# Altium project Network Interface.PRJPCB
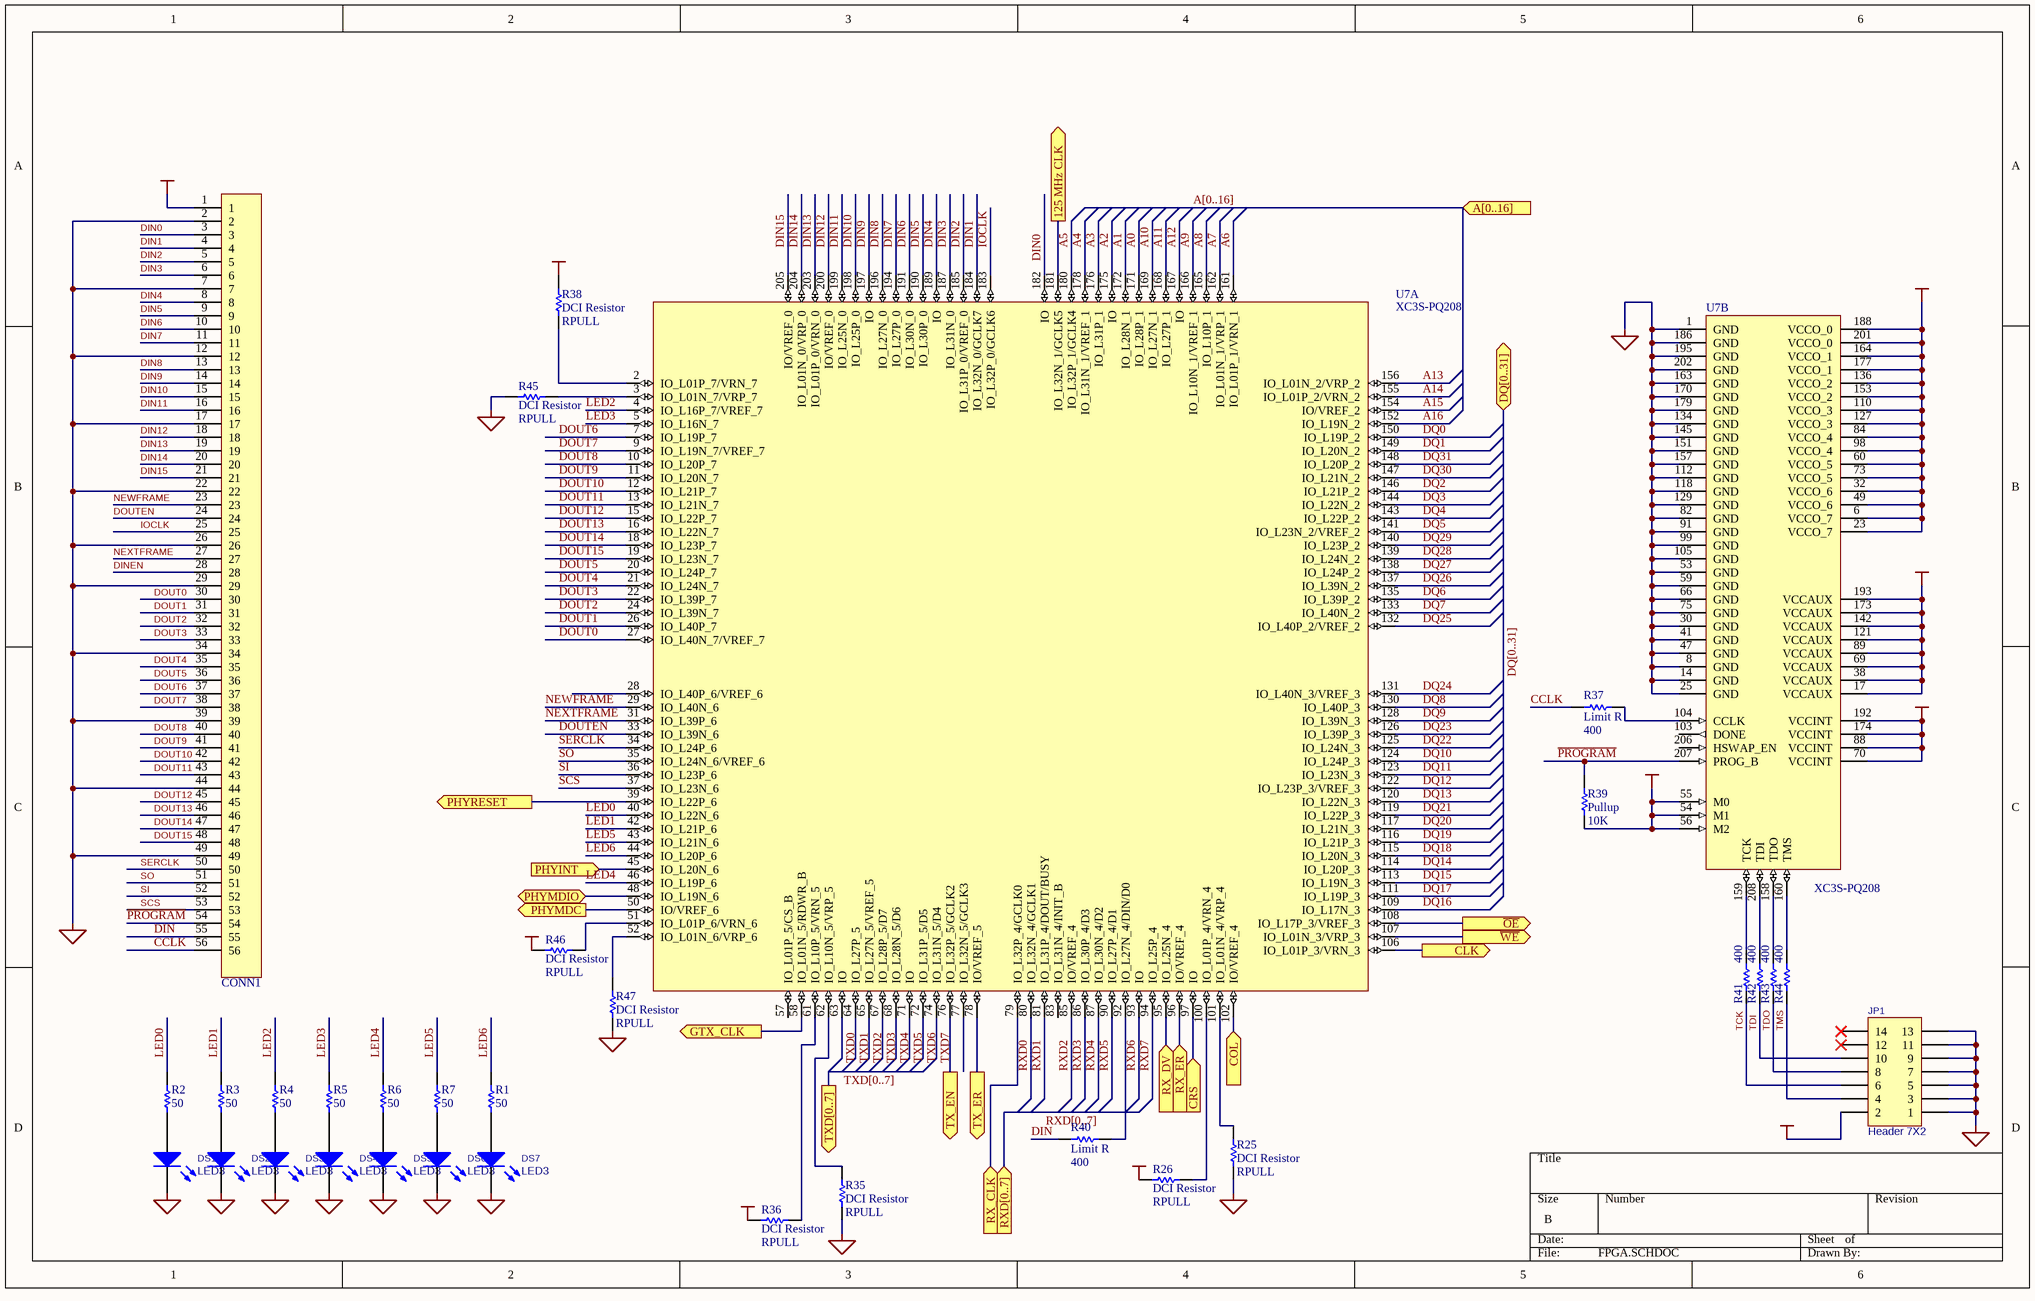
[diagram p0: FPGA.SCHDOC]
3 sheets, 152 parts. Net scope: hierarchical (ports join the sheet entries above them; power ports are global).
Board file: NIC.PCBDOC
Sheets:
  FPGA.SCHDOC
  Power and Clocks.SCHDOC
  PHY.SCHDOC

## Sheet FPGA.SCHDOC
size B

### Parts
CONN1  CON56B  [HDR56F]  (value not drawn)
DS1  LED3  [SMD _LED]
DS2  LED3  [SMD _LED]
DS3  LED3  [SMD _LED]
DS4  LED3  [SMD _LED]
DS5  LED3  [SMD _LED]
DS6  LED3  [SMD _LED]
DS7  LED3  [SMD _LED]
JP1  Header 7X2  [SMT 2x7 2mm HDR]
R1  value 50  [0603]  (hidden comment: RESISTOR)
R2  value 50  [0603]  (hidden comment: RESISTOR)
R3  value 50  [0603]  (hidden comment: RESISTOR)
R4  value 50  [0603]  (hidden comment: RESISTOR)
R5  value 50  [0603]  (hidden comment: RESISTOR)
R6  value 50  [0603]  (hidden comment: RESISTOR)
R7  value 50  [0603]  (hidden comment: RESISTOR)
R25  DCI Resistor  value RPULL  [0603]
R26  DCI Resistor  value RPULL  [0603]
R35  DCI Resistor  value RPULL  [0603]
R36  DCI Resistor  value RPULL  [0603]
R37  Limit R  value 400  [0603]
R38  DCI Resistor  value RPULL  [0603]
R39  Pullup  value 10K  [0603]
R40  Limit R  value 400  [0603]
R41  value 400  [0603]  (hidden comment: RESISTOR)
R42  value 400  [0603]  (hidden comment: RESISTOR)
R43  value 400  [0603]  (hidden comment: RESISTOR)
R44  value 400  [0603]  (hidden comment: RESISTOR)
R45  DCI Resistor  value RPULL  [0603]
R46  DCI Resistor  value RPULL  [0603]
R47  DCI Resistor  value RPULL  [0603]
U7  XC3S-PQ208  [F-QFP28X28-G208/Z32N]  (parts A,B of 2)

### Ports
125 MHz CLK (out), A[0..16] (out), CLK (out), COL (in), CRS (in), DQ[0..31] (bidir), GTX_CLK (out), PHYINT (in), PHYMDC (out), PHYMDIO (bidir), PHYRESET (out), RX_CLK (in), RX_DV (in), RX_ER (in), RXD[0..7] (in), TX_EN (out), TX_ER (out), TXD[0..7] (out), ~{OE} (out), ~{WE} (out)

### Nets
+1.2VCC: U7.70(VCCINT) U7.88(VCCINT) U7.174(VCCINT) U7.192(VCCINT)
+2.5VCC: U7.17(VCCAUX) U7.38(VCCAUX) U7.69(VCCAUX) U7.89(VCCAUX) U7.121(VCCAUX) U7.142(VCCAUX) U7.173(VCCAUX) U7.193(VCCAUX)
GND: CONN1.2 CONN1.7 CONN1.12 CONN1.17 CONN1.22 CONN1.26 CONN1.29 CONN1.34 CONN1.39 CONN1.44 CONN1.49 DS1.2(K) DS2.2(K) DS3.2(K) DS4.2(K) DS5.2(K) DS6.2(K) DS7.2(K) JP1.1 JP1.3 JP1.5 JP1.7 JP1.9 JP1.11 JP1.13 R25.1 R35.1 R45.2 R47.1 U7.1(GND) U7.8(GND) U7.14(GND) U7.25(GND) U7.30(GND) U7.41(GND) U7.47(GND) U7.53(GND) U7.59(GND) U7.66(GND) U7.75(GND) U7.82(GND) U7.91(GND) U7.99(GND) U7.105(GND) U7.112(GND) U7.118(GND) U7.129(GND) U7.134(GND) U7.145(GND) U7.151(GND) U7.157(GND) U7.163(GND) U7.170(GND) U7.179(GND) U7.186(GND) U7.195(GND) U7.202(GND)
VCC: CONN1.1 JP1.2 R26.2 R36.2 R38.2 R39.2 R46.2 U7.6(VCCO_7) U7.23(VCCO_7) U7.32(VCCO_6) U7.49(VCCO_6) U7.54(M1) U7.55(M0) U7.56(M2) U7.60(VCCO_5) U7.73(VCCO_5) U7.84(VCCO_4) U7.98(VCCO_4) U7.110(VCCO_3) U7.127(VCCO_3) U7.136(VCCO_2) U7.153(VCCO_2) U7.164(VCCO_1) U7.177(VCCO_1) U7.188(VCCO_0) U7.201(VCCO_0)
125 MHz CLK: U7.181(IO_L32N_1/GCLK5) ; port 125 MHz CLK
A0: U7.171(IO_L28P_1)
A1: U7.172(IO_L28N_1)
A2: U7.175(IO)
A3: U7.176(IO_L31P_1)
A4: U7.178(IO_L31N_1/VREF_1)
A5: U7.180(IO_L32P_1/GCLK4)
A6: U7.161(IO_L01P_1/VRN_1)
A7: U7.162(IO_L01N_1/VRP_1)
A8: U7.165(IO_L10P_1)
A9: U7.166(IO_L10N_1/VREF_1)
A10: U7.169(IO_L27N_1)
A11: U7.168(IO_L27P_1)
A12: U7.167(IO)
A13: U7.156(IO_L01N_2/VRP_2)
A14: U7.155(IO_L01P_2/VRN_2)
A15: U7.154(IO/VREF_2)
A16: U7.152(IO_L19N_2)
CCLK: CONN1.56 R37.2
CLK: U7.106(IO_L01P_3/VRN_3) ; port CLK
COL: U7.102(IO/VREF_4) ; port COL
CRS: U7.97(IO) ; port CRS
DIN: CONN1.55 R40.2
DIN0: CONN1.3 U7.182(IO)
DIN1: CONN1.4 U7.184(IO_L32N_0/GCLK7)
DIN2: CONN1.5 U7.185(IO_L31P_0/VREF_0)
DIN3: CONN1.6 U7.187(IO_L31N_0)
DIN4: CONN1.8 U7.189(IO)
DIN5: CONN1.9 U7.190(IO_L30P_0)
DIN6: CONN1.10 U7.191(IO_L30N_0)
DIN7: CONN1.11 U7.194(IO_L27P_0)
DIN8: CONN1.13 U7.196(IO_L27N_0)
DIN9: CONN1.14 U7.197(IO)
DIN10: CONN1.15 U7.198(IO_L25P_0)
DIN11: CONN1.16 U7.199(IO_L25N_0)
DIN12: CONN1.18 U7.200(IO/VREF_0)
DIN13: CONN1.19 U7.203(IO_L01P_0/VRN_0)
DIN14: CONN1.20 U7.204(IO_L01N_0/VRP_0)
DIN15: CONN1.21 U7.205(IO/VREF_0)
DINEN: CONN1.28
DOUT0: CONN1.30 U7.27(IO_L40N_7/VREF_7)
DOUT1: CONN1.31 U7.26(IO_L40P_7)
DOUT2: CONN1.32 U7.24(IO_L39N_7)
DOUT3: CONN1.33 U7.22(IO_L39P_7)
DOUT4: CONN1.35 U7.21(IO_L24N_7)
DOUT5: CONN1.36 U7.20(IO_L24P_7)
DOUT6: CONN1.37 U7.7(IO_L19P_7)
DOUT7: CONN1.38 U7.9(IO_L19N_7/VREF_7)
DOUT8: CONN1.40 U7.10(IO_L20P_7)
DOUT9: CONN1.41 U7.11(IO_L20N_7)
DOUT10: CONN1.42 U7.12(IO_L21P_7)
DOUT11: CONN1.43 U7.13(IO_L21N_7)
DOUT12: CONN1.45 U7.15(IO_L22P_7)
DOUT13: CONN1.46 U7.16(IO_L22N_7)
DOUT14: CONN1.47 U7.18(IO_L23P_7)
DOUT15: CONN1.48 U7.19(IO_L23N_7)
DOUTEN: CONN1.24 U7.33(IO_L39N_6)
DQ0: U7.150(IO_L19P_2)
DQ1: U7.149(IO_L20N_2)
DQ2: U7.146(IO_L21P_2)
DQ3: U7.144(IO_L22N_2)
DQ4: U7.143(IO_L22P_2)
DQ5: U7.141(IO_L23N_2/VREF_2)
DQ6: U7.135(IO_L39P_2)
DQ7: U7.133(IO_L40N_2)
DQ8: U7.130(IO_L40P_3)
DQ9: U7.128(IO_L39N_3)
DQ10: U7.124(IO_L24P_3)
DQ11: U7.123(IO_L23N_3)
DQ12: U7.122(IO_L23P_3/VREF_3)
DQ13: U7.120(IO_L22N_3)
DQ14: U7.114(IO_L20P_3)
DQ15: U7.113(IO_L19N_3)
DQ16: U7.109(IO_L17N_3)
DQ17: U7.111(IO_L19P_3)
DQ18: U7.115(IO_L20N_3)
DQ19: U7.116(IO_L21P_3)
DQ20: U7.117(IO_L21N_3)
DQ21: U7.119(IO_L22P_3)
DQ22: U7.125(IO_L24N_3)
DQ23: U7.126(IO_L39P_3)
DQ24: U7.131(IO_L40N_3/VREF_3)
DQ25: U7.132(IO_L40P_2/VREF_2)
DQ26: U7.137(IO_L39N_2)
DQ27: U7.138(IO_L24P_2)
DQ28: U7.139(IO_L24N_2)
DQ29: U7.140(IO_L23P_2)
DQ30: U7.147(IO_L21N_2)
DQ31: U7.148(IO_L20P_2)
GTX_CLK: U7.58(IO_L01N_5/RDWR_B) ; port GTX_CLK
IOCLK: CONN1.25 U7.183(IO_L32P_0/GCLK6)
LED0: R2.2 U7.40(IO_L22N_6)
LED1: R3.2 U7.42(IO_L21P_6)
LED2: R4.2 U7.4(IO_L16P_7/VREF_7)
LED3: R5.2 U7.5(IO_L16N_7)
LED4: R6.2 U7.46(IO_L19P_6)
LED5: R7.2 U7.43(IO_L21N_6)
LED6: R1.2 U7.44(IO_L20P_6)
NEWFRAME: CONN1.23 U7.29(IO_L40N_6)
NEXTFRAME: CONN1.27 U7.31(IO_L39P_6)
~{OE}: U7.108(IO_L17P_3/VREF_3) ; port ~{OE}
~{PROGRAM}: CONN1.54 R39.1 U7.207(PROG_B)
PHYINT: U7.45(IO_L20N_6) ; port PHYINT
PHYMDC: U7.50(IO/VREF_6) ; port PHYMDC
PHYMDIO: U7.48(IO_L19N_6) ; port PHYMDIO
PHYRESET: U7.39(IO_L22P_6) ; port PHYRESET
RX_CLK: U7.79(IO_L32P_4/GCLK0) ; port RX_CLK
RX_DV: U7.95(IO_L25N_4) ; port RX_DV
RX_ER: U7.96(IO/VREF_4) ; port RX_ER
RXD0: U7.80(IO_L32N_4/GCLK1)
RXD1: U7.81(IO_L31P_4/DOUT/BUSY)
RXD2: U7.85(IO/VREF_4)
RXD3: U7.86(IO_L30P_4/D3)
RXD4: U7.87(IO_L30N_4/D2)
RXD5: U7.90(IO_L27P_4/D1)
RXD6: U7.93(IO)
RXD7: U7.94(IO_L25P_4)
SCS: CONN1.53 U7.37(IO_L23N_6)
SERCLK: CONN1.50 U7.34(IO_L24P_6)
SI: CONN1.52 U7.36(IO_L23P_6)
SO: CONN1.51 U7.35(IO_L24N_6/VREF_6)
TCK: JP1.6 R41.2
TDI: JP1.10 R42.2
TDO: JP1.8 R43.2
TMS: JP1.4 R44.2
TX_EN: U7.76(IO_L32P_5/GCLK2) ; port TX_EN
TX_ER: U7.78(IO/VREF_5) ; port TX_ER
TXD0: U7.63(IO)
TXD1: U7.64(IO_L27P_5)
TXD2: U7.65(IO_L27N_5/VREF_5)
TXD3: U7.67(IO_L28P_5/D7)
TXD4: U7.68(IO_L28N_5/D6)
TXD5: U7.71(IO)
TXD6: U7.72(IO_L31P_5/D5)
TXD7: U7.74(IO_L31N_5/D4)
~{WE}: U7.107(IO_L01N_3/VRP_3) ; port ~{WE}
NetDS1_1: DS1.1(A) R2.1
NetDS2_1: DS2.1(A) R3.1
NetDS3_1: DS3.1(A) R4.1
NetDS4_1: DS4.1(A) R5.1
NetDS5_1: DS5.1(A) R6.1
NetDS6_1: DS6.1(A) R7.1
NetDS7_1: DS7.1(A) R1.1
NetR25_2: R25.2 U7.101(IO_L01N_4/VRP_4)
NetR26_1: R26.1 U7.100(IO_L01P_4/VRN_4)
NetR35_2: R35.2 U7.62(IO_L10N_5/VRP_5)
NetR36_1: R36.1 U7.61(IO_L10P_5/VRN_5)
NetR37_1: R37.1 U7.104(CCLK)
NetR38_1: R38.1 U7.2(IO_L01P_7/VRN_7)
NetR40_1: R40.1 U7.92(IO_L27N_4/DIN/D0)
NetR41_1: R41.1 U7.159(TCK)
NetR42_1: R42.1 U7.208(TDI)
NetR43_1: R43.1 U7.158(TDO)
NetR44_1: R44.1 U7.160(TMS)
NetR45_1: R45.1 U7.3(IO_L01N_7/VRP_7)
NetR46_1: R46.1 U7.51(IO_L01P_6/VRN_6)
NetR47_2: R47.2 U7.52(IO_L01N_6/VRP_6)

Not connected (* = marked no-connect by the designer): JP1 12* 14*; U7 28(IO_L40P_6/VREF_6) 57(IO_L01P_5/CS_B) 77(IO_L32N_5/GCLK3) 83(IO_L31N_4/INIT_B) 103(DONE) 206(HSWAP_EN)

### Buses and harness runs
bus A[0..16] = port A[0..16]
bus DQ[0..31] = port DQ[0..31]
bus RXD[0..7] = port RXD[0..7]
bus TXD[0..7] = port TXD[0..7]

### Library data of the parts
DS1-DS7 = LED3: Typical BLUE SiC LED; Published: 8-Jun-2000; LatestRevisionDate: 17-Dec-2003; LatestRevisionNote: PCB Footprint replaced.; Publisher: Altium Limited
JP1 = Header 7X2: Header, 7-Pin, Dual row; Manufacturer: Generic Components; Class I: Connector; Revision: July-2002: Re-released for DXP Platform.; Publisher: Altium Limited
R1-R7 R37 R40-R44 = RESISTOR: Standard Passive Resistor; Tolerance: 1%
R25 R26 R35 R36 R38 R39 R45-R47 = Res1: Resistor; Manufacturer: Generic Components; Class I: Passive; Published: 8-Jun-2000; Revision: July-2002: Re-released for DXP Platform.; Publisher: Altium Limited; Class II: Resistor
U7 = XC3S-PQ208: Xilinx Spartan-3 PQ208

## Sheet Power and Clocks.SCHDOC
size B
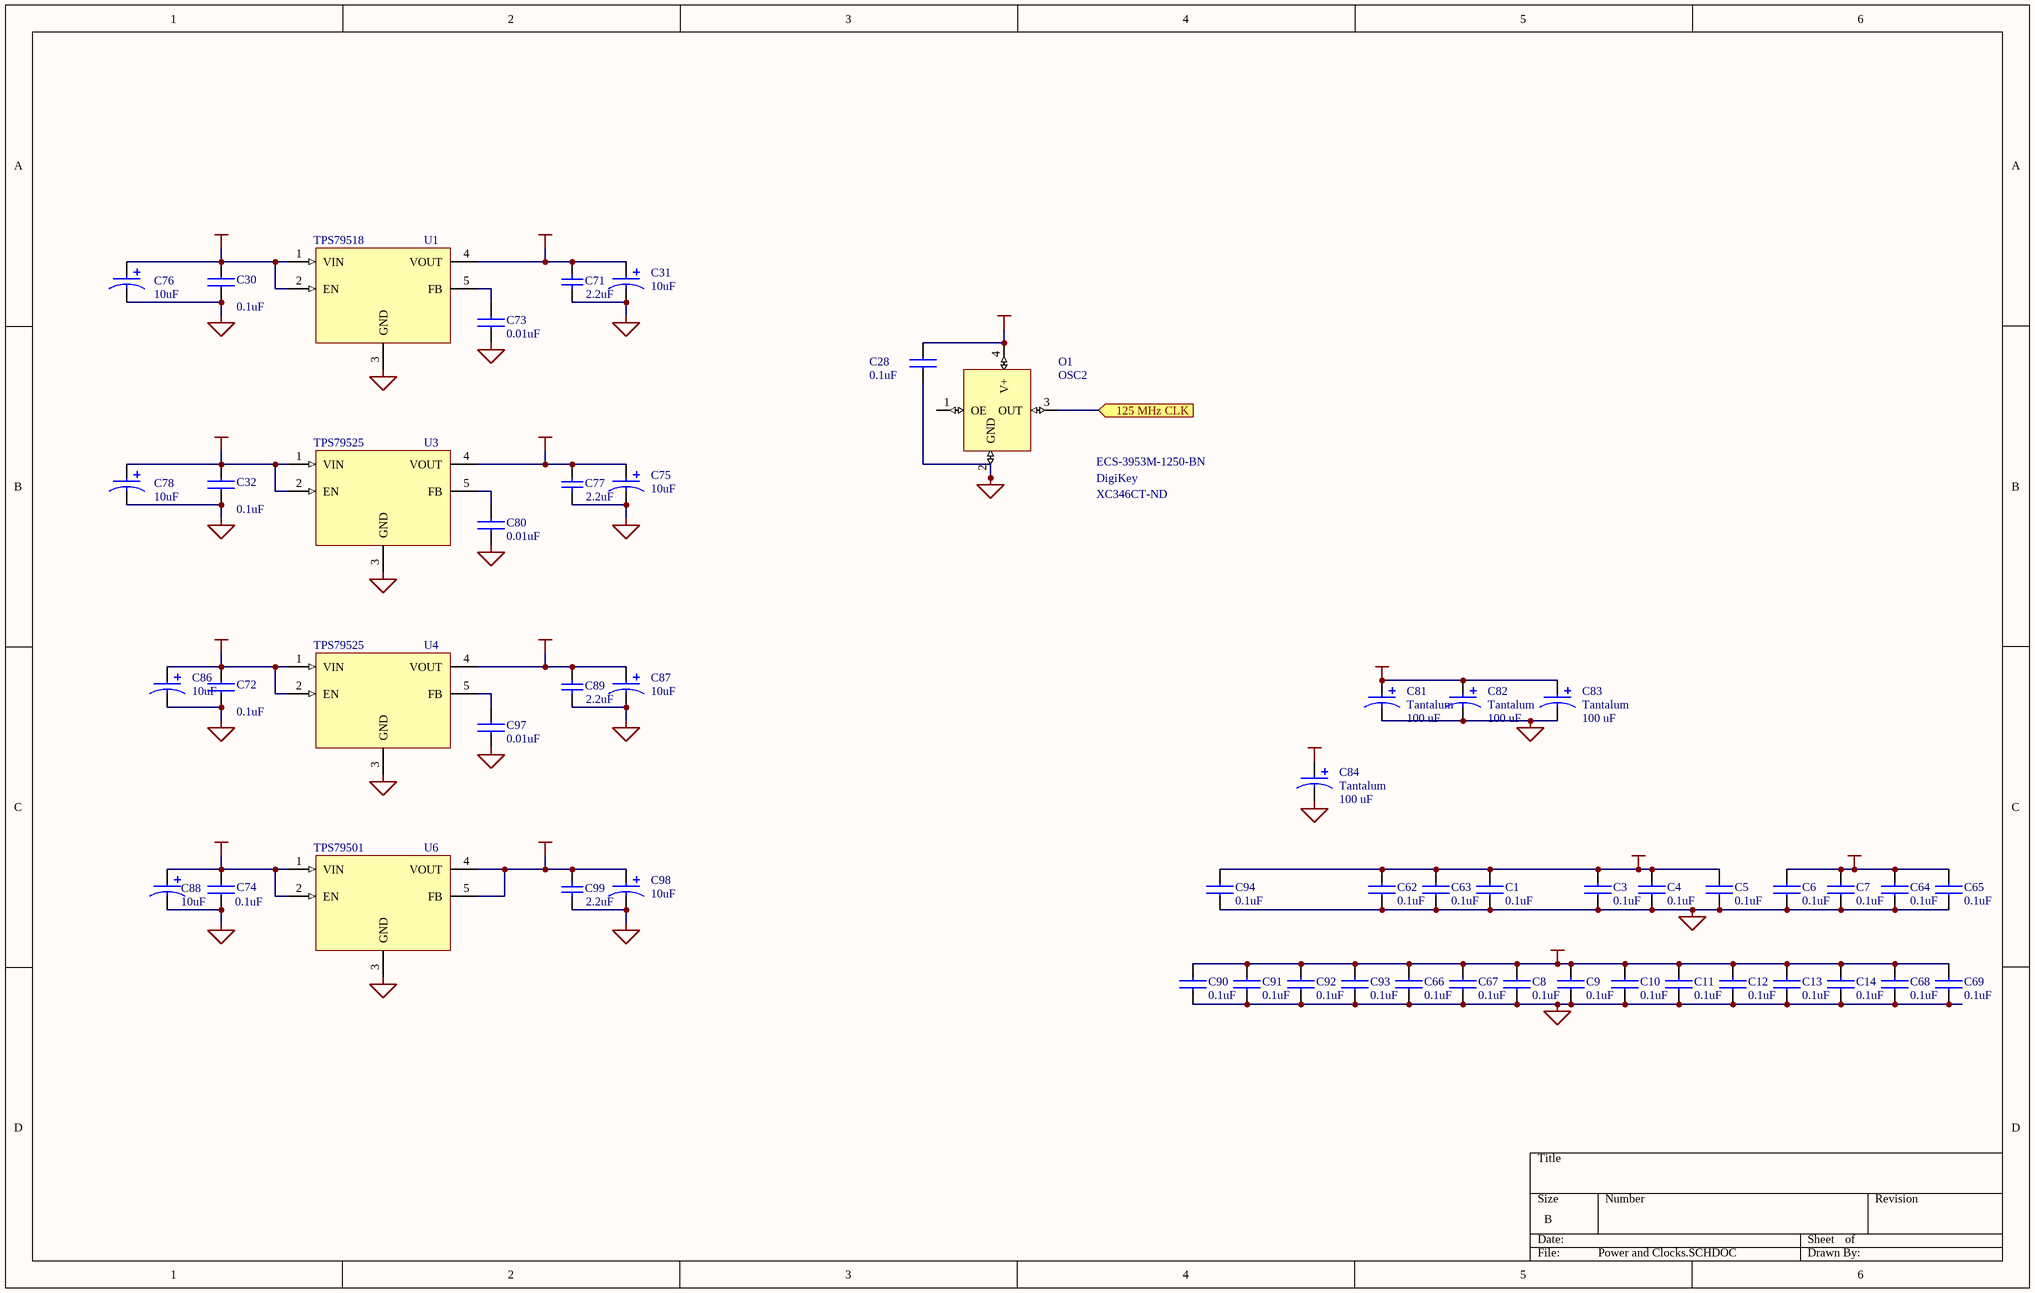
[diagram p1: Power and Clocks.SCHDOC]

### Parts
C1  value 0.1uF  [0603]  (hidden comment: CAPACITOR)
C3  value 0.1uF  [0603]  (hidden comment: CAPACITOR)
C4  value 0.1uF  [0603]  (hidden comment: CAPACITOR)
C5  value 0.1uF  [0603]  (hidden comment: CAPACITOR)
C6  value 0.1uF  [0603]  (hidden comment: CAPACITOR)
C7  value 0.1uF  [0603]  (hidden comment: CAPACITOR)
C8  value 0.1uF  [0603]  (hidden comment: CAPACITOR)
C9  value 0.1uF  [0603]  (hidden comment: CAPACITOR)
C10  value 0.1uF  [0603]  (hidden comment: CAPACITOR)
C11  value 0.1uF  [0603]  (hidden comment: CAPACITOR)
C12  value 0.1uF  [0603]  (hidden comment: CAPACITOR)
C13  value 0.1uF  [0603]  (hidden comment: CAPACITOR)
C14  value 0.1uF  [0603]  (hidden comment: CAPACITOR)
C28  value 0.1uF  [0603]  (hidden comment: CAPACITOR)
C30  value 0.1uF  [0603]  (hidden comment: CAPACITOR)
C31  value 10uF  [6032]  (hidden comment: POLCAP2)
C32  value 0.1uF  [0603]  (hidden comment: CAPACITOR)
C62  value 0.1uF  [0603]  (hidden comment: CAPACITOR)
C63  value 0.1uF  [0603]  (hidden comment: CAPACITOR)
C64  value 0.1uF  [0603]  (hidden comment: CAPACITOR)
C65  value 0.1uF  [0603]  (hidden comment: CAPACITOR)
C66  value 0.1uF  [0603]  (hidden comment: CAPACITOR)
C67  value 0.1uF  [0603]  (hidden comment: CAPACITOR)
C68  value 0.1uF  [0603]  (hidden comment: CAPACITOR)
C69  value 0.1uF  [0603]  (hidden comment: CAPACITOR)
C71  value 2.2uF  [1206]  (hidden comment: Cap)
C72  value 0.1uF  [0603]  (hidden comment: CAPACITOR)
C73  value 0.01uF  [0402]  (hidden comment: CAPACITOR)
C74  value 0.1uF  [0603]  (hidden comment: CAPACITOR)
C75  value 10uF  [6032]  (hidden comment: POLCAP2)
C76  value 10uF  [6032]  (hidden comment: POLCAP2)
C77  value 2.2uF  [1206]  (hidden comment: Cap)
C78  value 10uF  [6032]  (hidden comment: POLCAP2)
C80  value 0.01uF  [0402]  (hidden comment: CAPACITOR)
C81  Tantalum  value 100 uF  [6032]
C82  Tantalum  value 100 uF  [6032]
C83  Tantalum  value 100 uF  [6032]
C84  Tantalum  value 100 uF  [6032]
C86  value 10uF  [6032]  (hidden comment: POLCAP2)
C87  value 10uF  [6032]  (hidden comment: POLCAP2)
C88  value 10uF  [6032]  (hidden comment: POLCAP2)
C89  value 2.2uF  [1206]  (hidden comment: Cap)
C90  value 0.1uF  [0603]  (hidden comment: CAPACITOR)
C91  value 0.1uF  [0603]  (hidden comment: CAPACITOR)
C92  value 0.1uF  [0603]  (hidden comment: CAPACITOR)
C93  value 0.1uF  [0603]  (hidden comment: CAPACITOR)
C94  value 0.1uF  [0603]  (hidden comment: CAPACITOR)
C97  value 0.01uF  [0402]  (hidden comment: CAPACITOR)
C98  value 10uF  [6032]  (hidden comment: POLCAP2)
C99  value 2.2uF  [1206]  (hidden comment: Cap)
O1  OSC2  Part: ECS-3953M-1250-BN  Vendor: DigiKey  VendorPart: XC346CT-ND  [ECS-3953M]
U1  TPS79518  [SOT223-5/Simple]
U3  TPS79525  [SOT223-5/Simple]
U4  TPS79525  [SOT223-5/Simple]
U6  TPS79501  [SOT223-5/Simple]

### Ports
125 MHz CLK (in)

### Nets
+1.2VCC: C6.2 C7.2 C64.2 C65.2 C98.1 C99.2 U6.4(VOUT) U6.5(FB)
+1.8VCC: C31.1 C71.2 C84.1 U1.4(VOUT)
+2.5VCC: C1.2 C3.2 C4.2 C5.2 C62.2 C63.2 C75.1 C77.2 C94.2 U3.4(VOUT)
+2.5VPHY: C87.1 C89.2 U4.4(VOUT)
GND: C1.1 C3.1 C4.1 C5.1 C6.1 C7.1 C8.1 C9.1 C10.1 C11.1 C12.1 C13.1 C14.1 C28.1 C30.1 C31.2 C32.1 C62.1 C63.1 C64.1 C65.1 C66.1 C67.1 C68.1 C69.1 C71.1 C72.1 C73.1 C74.1 C75.2 C76.2 C77.1 C78.2 C80.1 C81.2 C82.2 C83.2 C84.2 C86.2 C87.2 C88.2 C89.1 C90.1 C91.1 C92.1 C93.1 C94.1 C97.1 C98.2 C99.1 O1.2(GND) U1.3(GND) U3.3(GND) U4.3(GND) U6.3(GND)
VCC: C8.2 C9.2 C10.2 C11.2 C12.2 C13.2 C14.2 C28.2 C30.2 C32.2 C66.2 C67.2 C68.2 C69.2 C72.2 C74.2 C76.1 C78.1 C81.1 C82.1 C83.1 C86.1 C88.1 C90.2 C91.2 C92.2 C93.2 O1.4(V+) U1.1(VIN) U1.2(EN) U3.1(VIN) U3.2(EN) U4.1(VIN) U4.2(EN) U6.1(VIN) U6.2(EN)
125 MHz CLK: O1.3(OUT) ; port 125 MHz CLK
NetC73_2: C73.2 U1.5(FB)
NetC80_2: C80.2 U3.5(FB)
NetC97_2: C97.2 U4.5(FB)

Not connected (* = marked no-connect by the designer): O1 1(OE)

### Library data of the parts
C1 C3-C14 C28 C30 C32 C62-C69 C72-C74 C80 C90-C94 C97 = CAPACITOR: Standard Capacitor
C31 C75 C76 C78 C81-C84 C86-C88 C98 = POLCAP2: Standard Capacitor
C71 C77 C89 C99 = Cap: Capacitor; Manufacturer: Generic Components; Class I: Passive; Published: 8-Jun-2000; Revision: July-2002: Re-released for DXP Platform.; Publisher: Altium Limited; Class II: Capacitor
O1 = OSC2: ECS SMD Oscillator, ECS-3953M
U1 U3 U4 U6 = TPS795XX: TI Ultra-low-noise LDO

## Sheet PHY.SCHDOC
size B
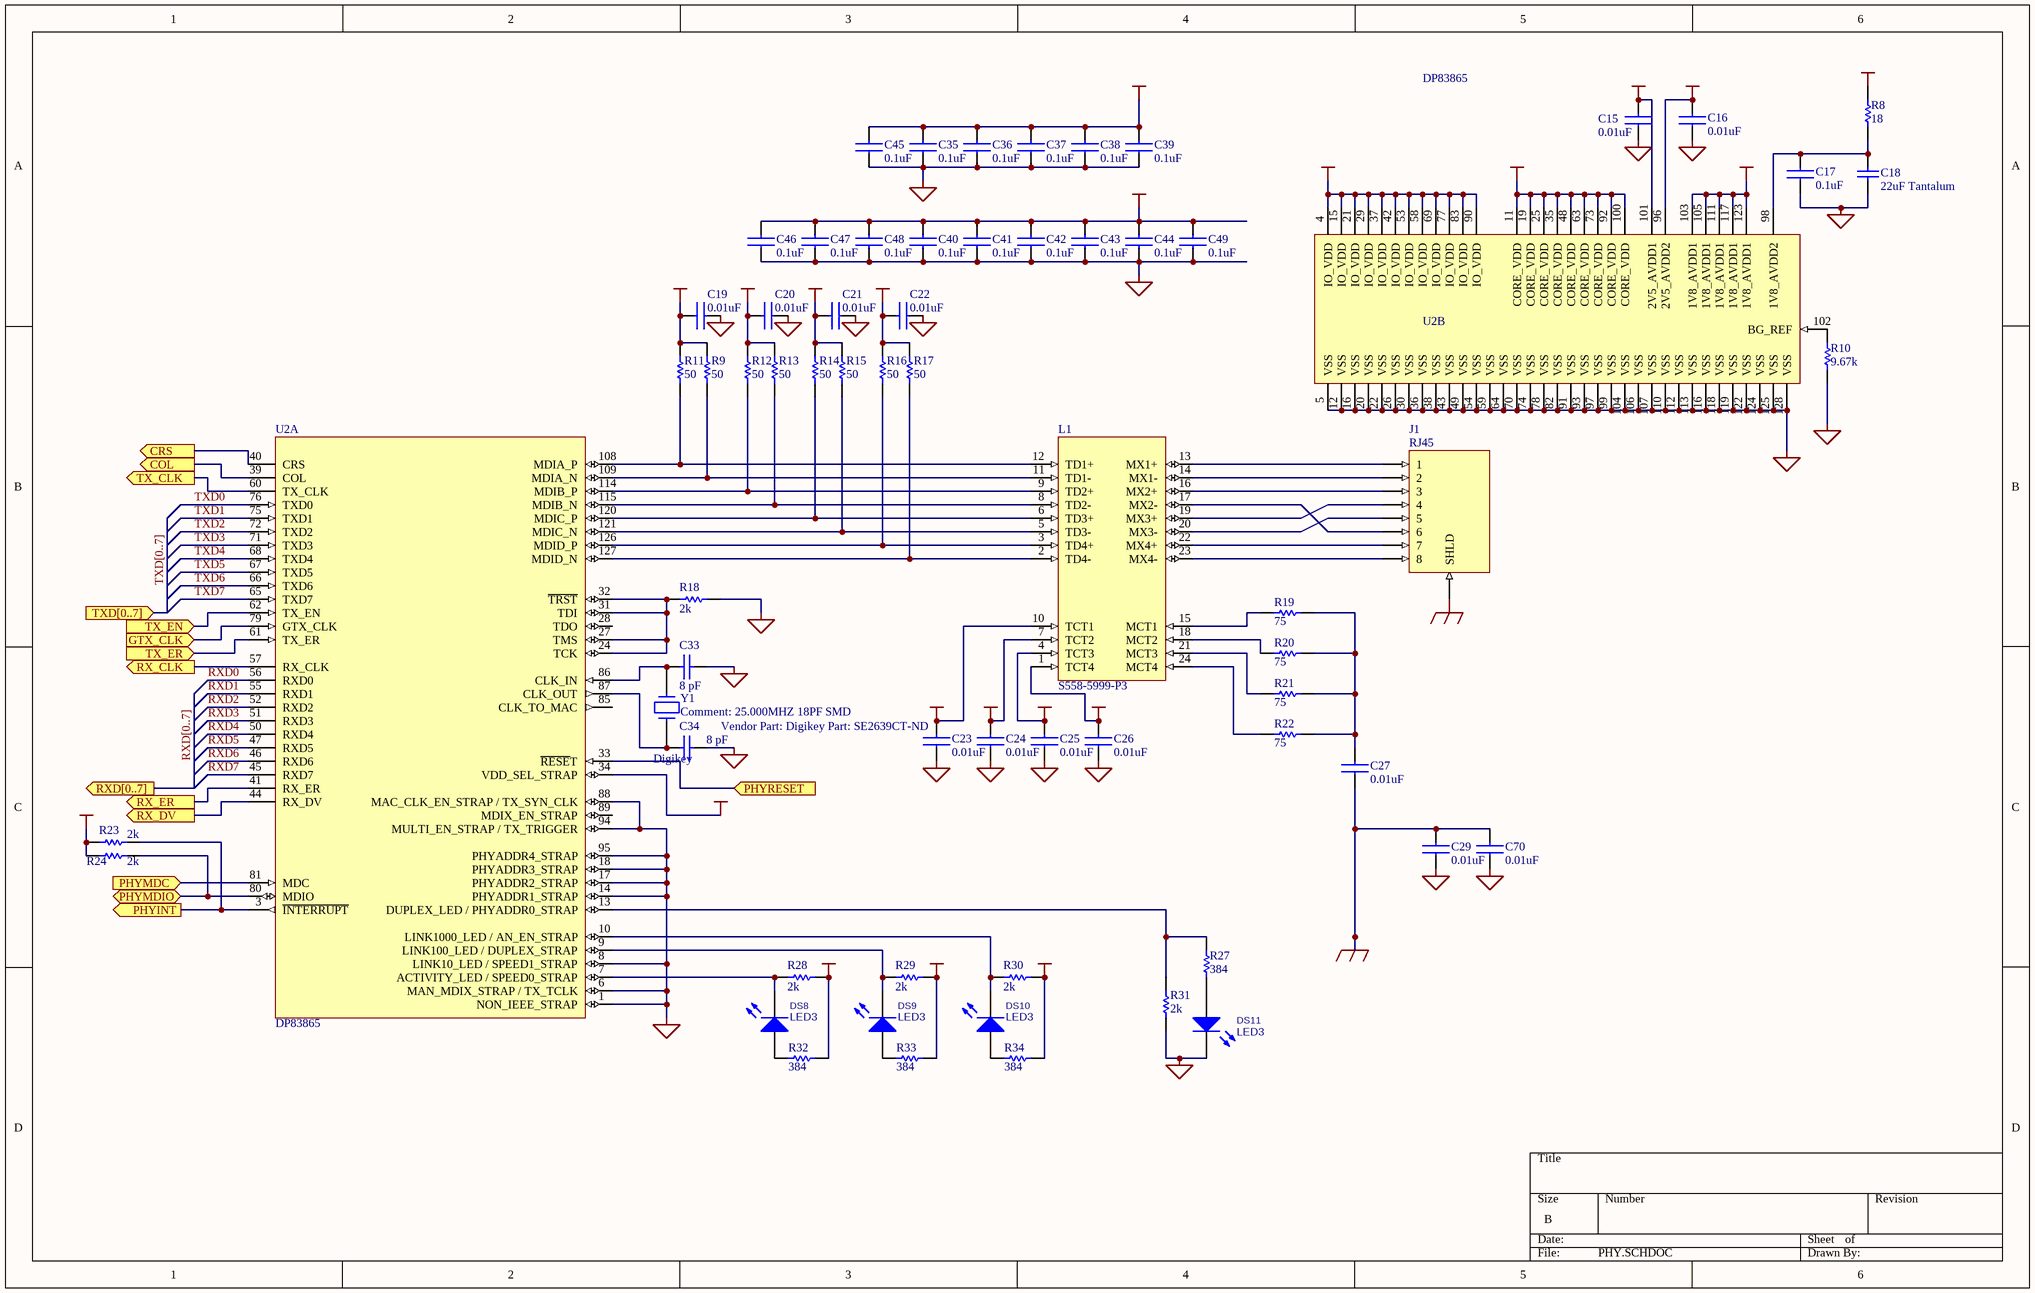
[diagram p2: PHY.SCHDOC]

### Parts
C15  value 0.01uF  [0402]  (hidden comment: CAPACITOR)
C16  value 0.01uF  [0402]  (hidden comment: CAPACITOR)
C17  value 0.1uF  [0603]  (hidden comment: CAPACITOR)
C18  value 22uF Tantalum  [TC7343-2917]  (hidden comment: Cap)
C19  value 0.01uF  [0402]  (hidden comment: CAPACITOR)
C20  value 0.01uF  [0402]  (hidden comment: CAPACITOR)
C21  value 0.01uF  [0402]  (hidden comment: CAPACITOR)
C22  value 0.01uF  [0402]  (hidden comment: CAPACITOR)
C23  value 0.01uF  [0402]  (hidden comment: CAPACITOR)
C24  value 0.01uF  [0402]  (hidden comment: CAPACITOR)
C25  value 0.01uF  [0402]  (hidden comment: CAPACITOR)
C26  value 0.01uF  [0402]  (hidden comment: CAPACITOR)
C27  value 0.01uF  [0402]  (hidden comment: CAPACITOR)
C29  value 0.01uF  [0402]  (hidden comment: CAPACITOR)
C33  8 pF  [0603]
C34  8 pF  [0603]
C35  value 0.1uF  [0603]  (hidden comment: CAPACITOR)
C36  value 0.1uF  [0603]  (hidden comment: CAPACITOR)
C37  value 0.1uF  [0603]  (hidden comment: CAPACITOR)
C38  value 0.1uF  [0603]  (hidden comment: CAPACITOR)
C39  value 0.1uF  [0603]  (hidden comment: CAPACITOR)
C40  value 0.1uF  [0603]  (hidden comment: CAPACITOR)
C41  value 0.1uF  [0603]  (hidden comment: CAPACITOR)
C42  value 0.1uF  [0603]  (hidden comment: CAPACITOR)
C43  value 0.1uF  [0603]  (hidden comment: CAPACITOR)
C44  value 0.1uF  [0603]  (hidden comment: CAPACITOR)
C45  value 0.1uF  [0603]  (hidden comment: CAPACITOR)
C46  value 0.1uF  [0603]  (hidden comment: CAPACITOR)
C47  value 0.1uF  [0603]  (hidden comment: CAPACITOR)
C48  value 0.1uF  [0603]  (hidden comment: CAPACITOR)
C49  value 0.1uF  [0603]  (hidden comment: CAPACITOR)
C70  value 0.01uF  [0402]  (hidden comment: CAPACITOR)
DS8  LED3  [SMD _LED]
DS9  LED3  [SMD _LED]
DS10  LED3  [SMD _LED]
DS11  LED3  [SMD _LED]
J1  RJ45  [MOLEXRJ45_44050-0007]
L1  S558-5999-P3  [S558-5999-P3]
R8  value 18  [0603]  (hidden comment: Res1)
R9  value 50  [0603]  (hidden comment: RESISTOR)
R10  value 9.67k  [0603]  (hidden comment: Res1)
R11  value 50  [0603]  (hidden comment: RESISTOR)
R12  value 50  [0603]  (hidden comment: RESISTOR)
R13  value 50  [0603]  (hidden comment: RESISTOR)
R14  value 50  [0603]  (hidden comment: RESISTOR)
R15  value 50  [0603]  (hidden comment: RESISTOR)
R16  value 50  [0603]  (hidden comment: RESISTOR)
R17  value 50  [0603]  (hidden comment: RESISTOR)
R18  value 2k  [0603]  (hidden comment: RESISTOR)
R19  value 75  [0603]  (hidden comment: Res1)
R20  value 75  [0603]  (hidden comment: Res1)
R21  value 75  [0603]  (hidden comment: Res1)
R22  value 75  [0603]  (hidden comment: Res1)
R23  value 2k  [0603]  (hidden comment: RESISTOR)
R24  value 2k  [0603]  (hidden comment: RESISTOR)
R27  value 384  [0603]  (hidden comment: Res1)
R28  value 2k  [0603]  (hidden comment: RESISTOR)
R29  value 2k  [0603]  (hidden comment: RESISTOR)
R30  value 2k  [0603]  (hidden comment: RESISTOR)
R31  value 2k  [0603]  (hidden comment: RESISTOR)
R32  value 384  [0603]  (hidden comment: Res1)
R33  value 384  [0603]  (hidden comment: Res1)
R34  value 384  [0603]  (hidden comment: Res1)
U2  DP83865  [PQFP128RECT]  (parts A,B of 2)
Y1  25.000MHZ 18PF SMD  Vendor Part: Digikey Part: SE2639CT-ND  Vendor: Digikey  [EPSON_MA-506]

### Ports
COL (out), CRS (out), GTX_CLK (in), PHYINT (out), PHYMDC (in), PHYMDIO (bidir), PHYRESET (in), RX_CLK (out), RX_DV (out), RX_ER (out), RXD[0..7] (out), TX_CLK (out), TX_EN (in), TX_ER (in), TXD[0..7] (in)

### Nets
+1.8VCC: C40.1 C41.1 C42.1 C43.1 C44.1 C46.1 C47.1 C48.1 C49.1 R8.2 U2.11(CORE_VDD) U2.19(CORE_VDD) U2.25(CORE_VDD) U2.35(CORE_VDD) U2.48(CORE_VDD) U2.63(CORE_VDD) U2.73(CORE_VDD) U2.92(CORE_VDD) U2.100(CORE_VDD) U2.103(1V8_AVDD1) U2.105(1V8_AVDD1) U2.111(1V8_AVDD1) U2.117(1V8_AVDD1) U2.123(1V8_AVDD1)
+2.5VPHY: C15.2 C16.2 C19.1 C20.1 C21.1 C22.1 C23.2 C24.2 C25.2 C26.2 L1.1(TCT4) L1.4(TCT3) L1.7(TCT2) L1.10(TCT1) R9.2 R11.2 R12.2 R13.2 R14.2 R15.2 R16.2 R17.2 U2.96(2V5_AVDD2) U2.101(2V5_AVDD1)
CGND: C27.1 C29.2 C70.2 J1.9(SHLD)
GND: C15.1 C16.1 C17.1 C18.1 C19.2 C20.2 C21.2 C22.2 C23.1 C24.1 C25.1 C26.1 C29.1 C33.2 C34.2 C35.2 C36.2 C37.2 C38.2 C39.2 C40.2 C41.2 C42.2 C43.2 C44.2 C45.2 C46.2 C47.2 C48.2 C49.2 C70.1 DS11.2(K) R10.1 R18.2 R31.1 U2.1(NON_IEEE_STRAP) U2.5(VSS) U2.6(MAN_MDIX_STRAP_/_TX_TCLK) U2.8(LINK10_LED_/_SPEED1_STRAP) U2.12(VSS) U2.14(PHYADDR1_STRAP) U2.16(VSS) U2.17(PHYADDR2_STRAP) U2.18(PHYADDR3_STRAP) U2.20(VSS) U2.22(VSS) U2.26(VSS) U2.30(VSS) U2.36(VSS) U2.38(VSS) U2.43(VSS) U2.49(VSS) U2.54(VSS) U2.59(VSS) U2.64(VSS) U2.70(VSS) U2.74(VSS) U2.78(VSS) U2.82(VSS) U2.88(MAC_CLK_EN_STRAP_/_TX_SYN_CLK) U2.91(VSS) U2.93(VSS) U2.94(MULTI_EN_STRAP_/_TX_TRIGGER) U2.95(PHYADDR4_STRAP) U2.97(VSS) U2.99(VSS) U2.104(VSS) U2.106(VSS) U2.107(VSS) U2.110(VSS) U2.112(VSS) U2.113(VSS) U2.116(VSS) U2.118(VSS) U2.119(VSS) U2.122(VSS) U2.124(VSS) U2.125(VSS) U2.128(VSS)
VCC: C35.1 C36.1 C37.1 C38.1 C39.1 C45.1 R23.1 R24.1 R28.2 R29.2 R30.2 R32.2 R33.2 R34.2 U2.4(IO_VDD) U2.15(IO_VDD) U2.21(IO_VDD) U2.29(IO_VDD) U2.34(VDD_SEL_STRAP) U2.37(IO_VDD) U2.42(IO_VDD) U2.53(IO_VDD) U2.58(IO_VDD) U2.69(IO_VDD) U2.77(IO_VDD) U2.83(IO_VDD) U2.90(IO_VDD)
COL: U2.39(COL) ; port COL
CRS: U2.40(CRS) ; port CRS
GTX_CLK: U2.79(GTX_CLK) ; port GTX_CLK
PHYINT: R23.2 U2.3(~{INTERRUPT}) ; port PHYINT
PHYMDC: U2.81(MDC) ; port PHYMDC
PHYMDIO: R24.2 U2.80(MDIO) ; port PHYMDIO
PHYRESET: U2.33(~{RESE}T) ; port PHYRESET
RX_CLK: U2.57(RX_CLK) ; port RX_CLK
RX_DV: U2.44(RX_DV) ; port RX_DV
RX_ER: U2.41(RX_ER) ; port RX_ER
RXD0: U2.56(RXD0)
RXD1: U2.55(RXD1)
RXD2: U2.52(RXD2)
RXD3: U2.51(RXD3)
RXD4: U2.50(RXD4)
RXD5: U2.47(RXD5)
RXD6: U2.46(RXD6)
RXD7: U2.45(RXD7)
TX_CLK: U2.60(TX_CLK) ; port TX_CLK
TX_EN: U2.62(TX_EN) ; port TX_EN
TX_ER: U2.61(TX_ER) ; port TX_ER
TXD0: U2.76(TXD0)
TXD1: U2.75(TXD1)
TXD2: U2.72(TXD2)
TXD3: U2.71(TXD3)
TXD4: U2.68(TXD4)
TXD5: U2.67(TXD5)
TXD6: U2.66(TXD6)
TXD7: U2.65(TXD7)
NetC17_2: C17.2 C18.2 R8.1 U2.98(1V8_AVDD2)
NetC27_2: C27.2 R19.1 R20.1 R21.1 R22.1
NetC33_1: C33.1 U2.86(CLK_IN) Y1.1
NetC34_1: C34.1 U2.87(CLK_OUT) Y1.2
NetDS8_1: DS8.1(A) R32.1
NetDS8_2: DS8.2(K) R28.1 U2.7(ACTIVITY_LED_/_SPEED0_STRAP)
NetDS9_1: DS9.1(A) R33.1
NetDS9_2: DS9.2(K) R29.1 U2.9(LINK100_LED_/_DUPLEX_STRAP)
NetDS10_1: DS10.1(A) R34.1
NetDS10_2: DS10.2(K) R30.1 U2.10(LINK1000_LED_/_AN_EN_STRAP)
NetDS11_1: DS11.1(A) R27.1
NetJ1_1: J1.1 L1.13(MX1+)
NetJ1_2: J1.2 L1.14(MX1-)
NetJ1_3: J1.3 L1.16(MX2+)
NetJ1_4: J1.4 L1.19(MX3+)
NetJ1_5: J1.5 L1.20(MX3-)
NetJ1_6: J1.6 L1.17(MX2-)
NetJ1_7: J1.7 L1.22(MX4+)
NetJ1_8: J1.8 L1.23(MX4-)
NetL1_2: L1.2(TD4-) R17.1 U2.127(MDID_N)
NetL1_3: L1.3(TD4+) R16.1 U2.126(MDID_P)
NetL1_5: L1.5(TD3-) R15.1 U2.121(MDIC_N)
NetL1_6: L1.6(TD3+) R14.1 U2.120(MDIC_P)
NetL1_8: L1.8(TD2-) R13.1 U2.115(MDIB_N)
NetL1_9: L1.9(TD2+) R12.1 U2.114(MDIB_P)
NetL1_11: L1.11(TD1-) R9.1 U2.109(MDIA_N)
NetL1_12: L1.12(TD1+) R11.1 U2.108(MDIA_P)
NetL1_15: L1.15(MCT1) R19.2
NetL1_18: L1.18(MCT2) R20.2
NetL1_21: L1.21(MCT3) R21.2
NetL1_24: L1.24(MCT4) R22.2
NetR10_2: R10.2 U2.102(BG_REF)
NetR18_1: R18.1 U2.24(TCK) U2.27(TMS) U2.31(TDI) U2.32(~{TRST})
NetR27_2: R27.2 R31.2 U2.13(DUPLEX_LED_/_PHYADDR0_STRAP)

Not connected (* = marked no-connect by the designer): U2 28(TDO) 85(CLK_TO_MAC) 89(MDIX_EN_STRAP)

### Buses and harness runs
bus RXD[0..7] = port RXD[0..7]
bus TXD[0..7] = port TXD[0..7]

### Library data of the parts
C15-C17 C19-C27 C29 C35-C49 C70 = CAPACITOR: Standard Capacitor
C18 = Cap: as C71 on sheet Power and Clocks; Published: 8-Jun-2000; Revision: July-2002: Re-released for DXP Platform.; Publisher: Altium Limited; Class II: Capacitor
C33 C34 = CAP: Capacitor
DS8-DS11 = LED3: Typical BLUE SiC LED; Published: 8-Jun-2000; LatestRevisionDate: 17-Dec-2003; LatestRevisionNote: PCB Footprint replaced.; Publisher: Altium Limited
J1 = RJ45: RJ-45 connector
L1 = S558-5999-P3: BEL 1000base-T magnetics S588-5999-P3
R8 R10 R19-R22 R27 R32-R34 = Res1: as R25 on sheet FPGA; Published: 8-Jun-2000; Revision: July-2002: Re-released for DXP Platform.; Publisher: Altium Limited; Class II: Resistor
R9 R11-R18 R23 R24 R28-R31 = RESISTOR: Standard Passive Resistor; Tolerance: 1%
U2 = DP83865: National Semiconductor Gigabit PHY
Y1 = CRYSTAL: Crystal MA-506 25.000M-C0

## Nets that join several sheets
+1.2VCC: FPGA (U7.70 U7.88 U7.174 U7.192), Power and Clocks (8 pins)
+1.8VCC: Power and Clocks (C31.1 C71.2 C84.1 U1.4), PHY (24 pins)
+2.5VCC: FPGA (8 pins), Power and Clocks (10 pins)
+2.5VPHY: Power and Clocks (C87.1 C89.2 U4.4), PHY (24 pins)
GND: FPGA (57 pins), Power and Clocks (55 pins), PHY (79 pins)
VCC: FPGA (26 pins), Power and Clocks (36 pins), PHY (27 pins)